# EAGLE design MPPC_POS_FINALFINAL (EAGLE 6.6.0)
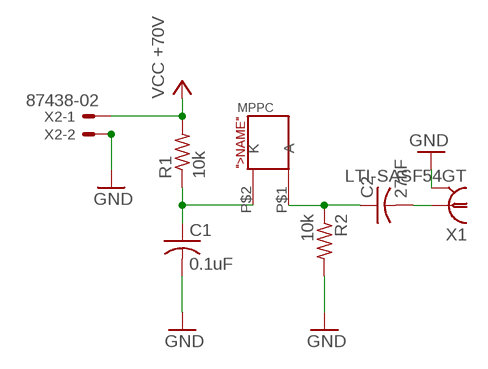
[diagram p0: schematic, sheet 1]

## Parts
C1  0.1uF  C-USC1206  [C1206]
C2  27nF  C-USC1206  [C1206]
R1  10k  R-US_R1206  [R1206]
R2  10k  R-US_R1206  [R1206]
U$1  MPPC-S12572-025C  [MPPC_V2]
X1  LTI-SASF54GT  [LTI-SASF54GT]
X2  87438-02  [87438-02]

## Nets
GND: C1.2 R2.2 X1.2 X1.3 X1.4 X1.5 X2.2
N$1: C1.1 R1.1 U$1.P$2(K)
N$2: C2.1 R2.1 U$1.P$1(A)
N$3: C2.2 X1.1
VCC: R1.2 X2.1 ; supply symbol labelled VCC +70V

## Library data of the parts
C1 C2 = resistor:C-US: CAPACITOR, American symbol
R1 R2 = resistor:R-US_: RESISTOR, American symbol
U$1 = MPPC:MPPC-S12572-025C
X1 = con-coax:LTI-SASF54GT: SMA vertical PCB thrue hole jack Source: Lighthorse Technologies, inc. SASF54GT.pdf; OC_FARNELL: unknown; OC_NEWARK: unknown
X2 = con-molex:87438-02: Wire-to-Board 1.50mm (.059") Pitch Header - Right Angle, SMT, Shrouded Source: http://www.molex.com/product/micro/87438.html; OC_FARNELL: 1711327; OC_NEWARK: unknown

## Net classes
0 default: width 0.305 mm, drill 0.483 mm, clearance 0.254 mm

## Board
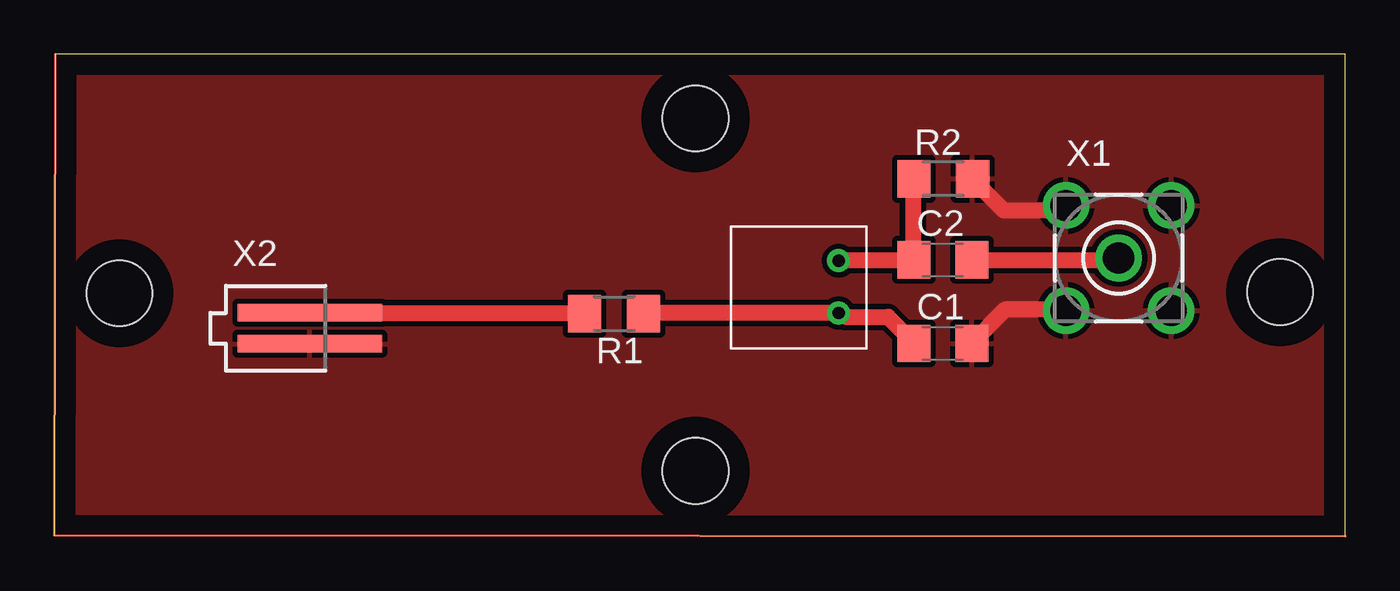
[diagram p1: board, top side]

Size 62.4 x 23.31 mm. Coordinates in mm from the lower left corner, seen from the top.
Outline: 0,0.05 62.4,0 62.4,23.31 0.05,23.31 0,0.05
Copper layers (1*16): Top 0.035mm / dielectric 1.5mm / Bottom 0.035mm
Design rules "default *": minimum track width 30mil, minimum drill 36mil, track to track 8mil, track to pad 8mil, pad to pad 8mil, via to via 8mil, smd to smd 8mil, copper to edge 40mil, drill to drill 8mil, minimum pad ring 10mil, minimum via ring 8mil, stop-mask expansion 4mil, vias tented up to drill 0mil, thermal gap 10mil
Holes 3.17 mm at 3.15,11.76 59.25,11.81 31,20.21 31,3.16

### Footprints (pad centres in the part's own frame; a part is rotated, then mirrored left to right if it is on the bottom)
C1206 = smd 1.6 x 1.8: 1 -1.4,0; 2 1.4,0
R1206 = smd 1.6 x 1.803: 1 -1.422,0; 2 1.422,0
MPPC_V2 = drill 0.6: P$1 1.65,5.2; P$2 4.18,5.2
LTI-SASF54GT = drill 1.5 pad 2.2: 1 0,0; 2 -2.54,2.54; 3 2.54,2.54; 4 2.54,-2.54; 5 -2.54,-2.54
87438-02 = smd 7 x 0.85: 1 0,0.75; 2 0,-0.75

### Placement (x,y rotation side)
C1  42.95,9.33 0 top
C2  42.95,13.37 0 top
R1  27.06,10.77 180 top
R2  42.97,17.29 0 top
U$1  32.71,14.98 270 top
X1  51.45,13.46 0 top
X2  12.35,10.06 0 top

### Tracks (layer width: path | path; a pad name or v marks a point on that pad's centre or on a via)
GND
  Top 0.762: 48.9,15.76 45.9,15.76 44.4,17.26 R2.2 | 48.9,10.96 45.95,10.96 44.35,9.36 C1.2
  pour Top (isolate 0.016): 0.25,23.11 62.35,23.21 62.3,0.16 0.2,0.21
N$1
  Top 0.406: 37.91,10.77 U$1.P$2
  Top 0.762: R1.1 28.5,10.81 37.55,10.81 U$1.P$2 38.25,10.61 40.3,10.61 41.55,9.36 C1.1
N$2
  Top 0.406: 41.55,13.33 C2.1
  Top 0.762: 37.95,13.36 U$1.P$1 38.3,13.36 40.85,13.36 C2.1 | 41.2,13.36 C2.1 | C2.1 41.5,13.71 41.5,17.26 R2.1
N$3
  Top 0.762: C2.2 44.7,13.36 51.1,13.36 X1.1
VCC
  Top 0.762: 25.6,10.81 R1.2 25.25,10.81 X2.1
(copper drawn outside any net)
  shapes: Top area x2